# EAGLE schematic DDS Tone Shield (EAGLE 8.1.1)
REV: 0.10
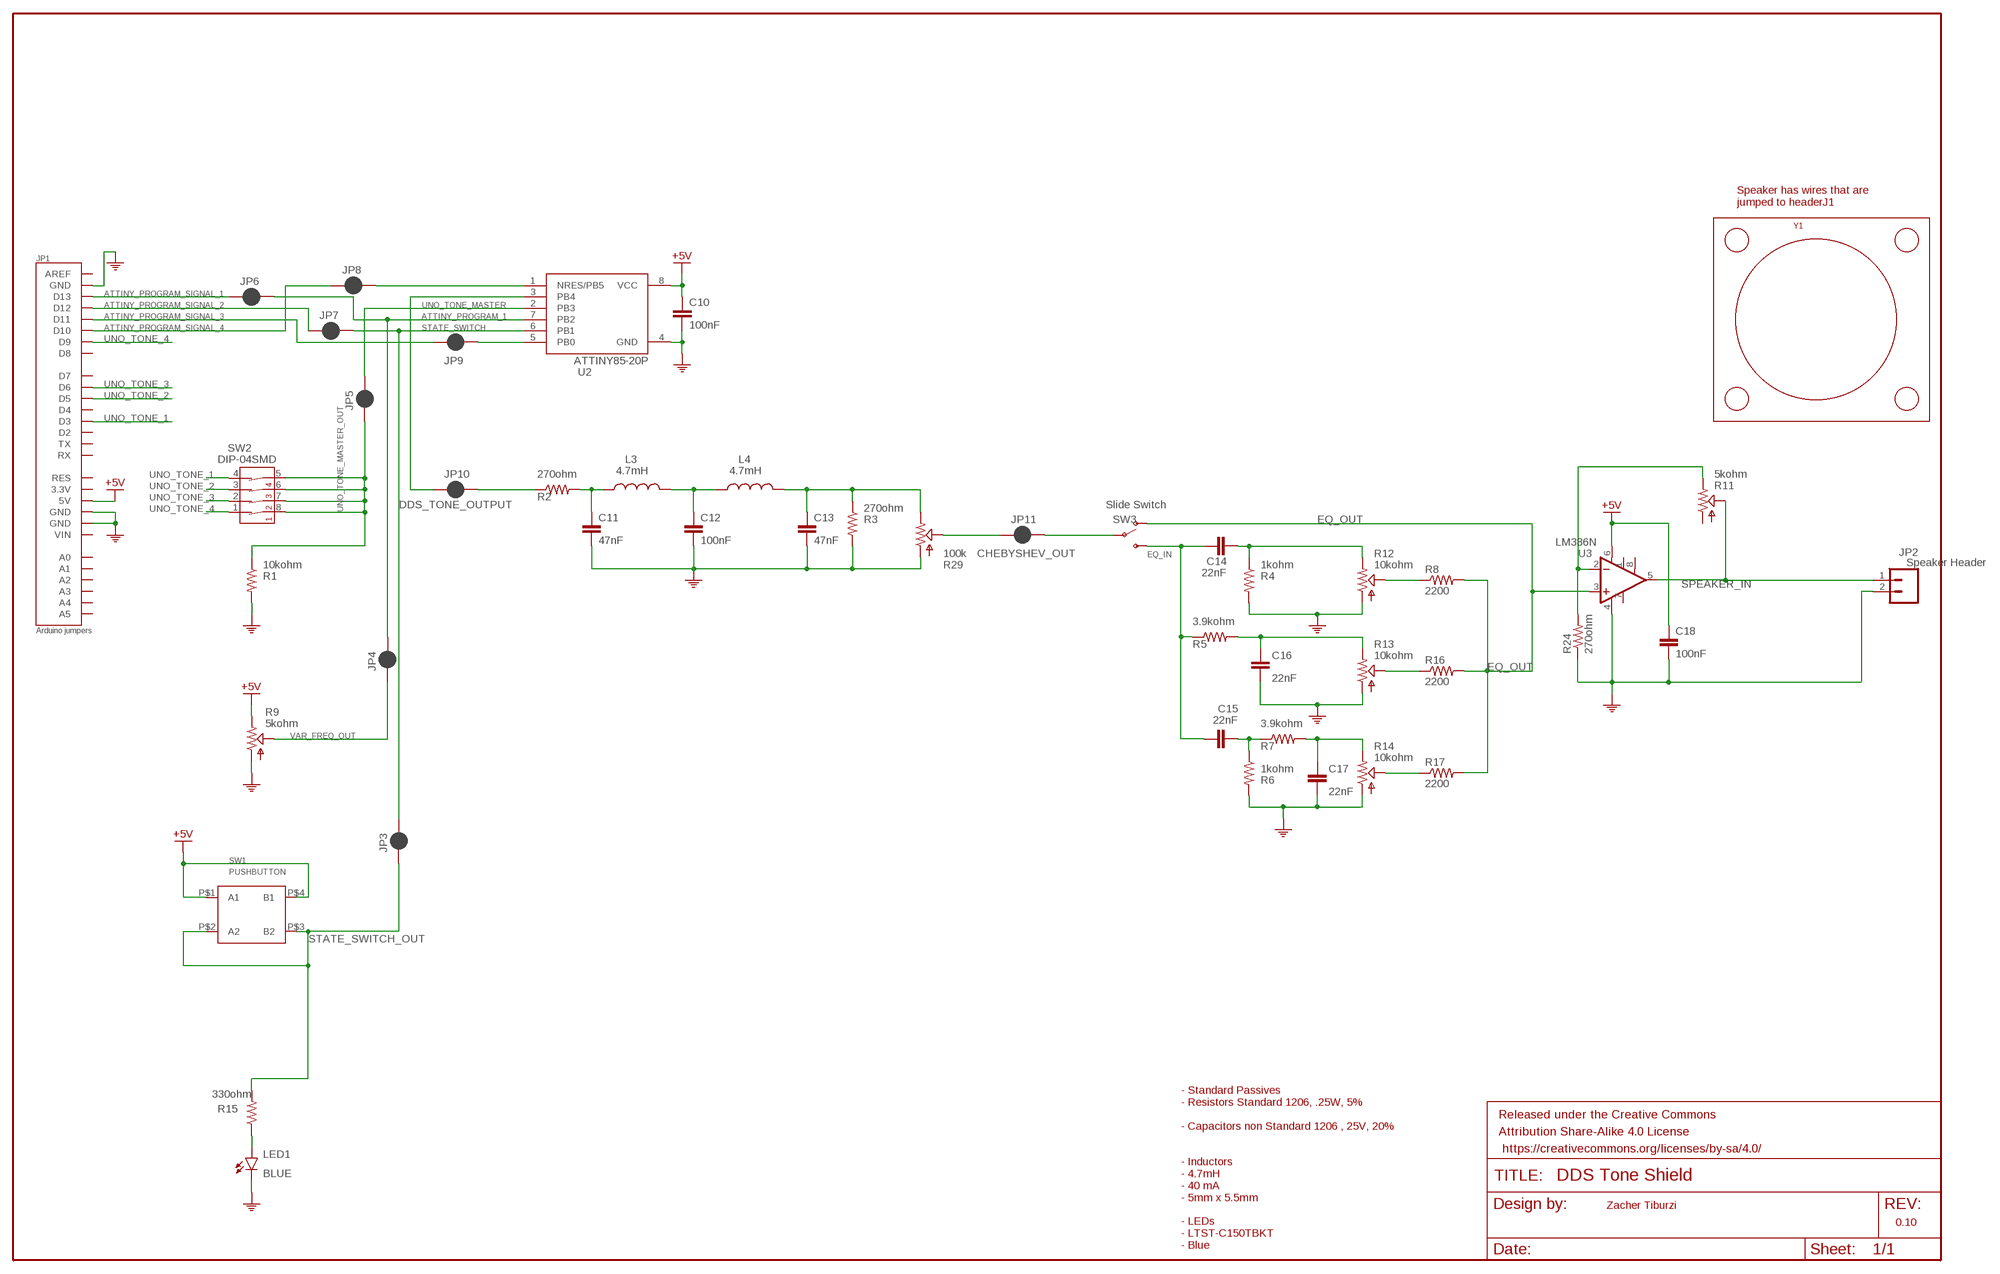
[diagram p0: schematic, sheet 1]

## Parts
C10  100nF  CAP1206  [EIA3216]
C11  47nF  CAP1206  [EIA3216]
C12  100nF  CAP1206  [EIA3216]
C13  47nF  CAP1206  [EIA3216]
C14  22nF  CAP1206  [EIA3216]
C15  22nF  CAP1206  [EIA3216]
C16  22nF  CAP1206  [EIA3216]
C17  22nF  CAP1206  [EIA3216]
C18  100nF  CAP1206  [EIA3216]
FRAME2  FRAME-LEDGER  [CREATIVE_COMMONS]
JP1  Arduino jumpers  ARDUINO_SHIELD  [DUEMILANOVE_SHIELD]
JP2  Speaker Header  CONN_02  [1X02]
JP3  JUMPER-SMT_2_NC_PASTE_SILK  [SMT-JUMPER_2_NC_PASTE_SILK]
JP4  JUMPER-SMT_2_NC_PASTE_SILK  [SMT-JUMPER_2_NC_PASTE_SILK]
JP5  JUMPER-SMT_2_NC_PASTE_SILK  [SMT-JUMPER_2_NC_PASTE_SILK]
JP6  JUMPER-SMT_2_NC_PASTE_SILK  [SMT-JUMPER_2_NC_PASTE_SILK]
JP7  JUMPER-SMT_2_NC_PASTE_SILK  [SMT-JUMPER_2_NC_PASTE_SILK]
JP8  JUMPER-SMT_2_NC_PASTE_SILK  [SMT-JUMPER_2_NC_PASTE_SILK]
JP9  JUMPER-SMT_2_NC_PASTE_SILK  [SMT-JUMPER_2_NC_PASTE_SILK]
JP10  JUMPER-SMT_2_NC_PASTE_SILK  [SMT-JUMPER_2_NC_PASTE_SILK]
JP11  JUMPER-SMT_2_NC_PASTE_SILK  [SMT-JUMPER_2_NC_PASTE_SILK]
L3  4.7mH  INDUCTOR_  [SDR0503-472JL]
L4  4.7mH  INDUCTOR_  [SDR0503-472JL]
LED1  BLUE  LED-BLUE1206  [LED-1206]
R1  10kohm  RESISTOR1206  [1206]
R2  270ohm  RESISTOR1206  [1206]
R3  270ohm  RESISTOR1206  [1206]
R4  1kohm  RESISTOR1206  [1206]
R5  3.9kohm  RESISTOR1206  [1206]
R6  1kohm  RESISTOR1206  [1206]
R7  3.9kohm  RESISTOR1206  [1206]
R8  2200  RESISTOR1206  [1206]
R9  5kohm  POT1  [RK09K/RK09D_SERIES]
R11  5kohm  POT1  [RK09K/RK09D_SERIES]
R12  10kohm  POT1  [RK09K/RK09D_SERIES]
R13  10kohm  POT1  [RK09K/RK09D_SERIES]
R14  10kohm  POT1  [RK09K/RK09D_SERIES]
R15  330ohm  RESISTOR1206  [1206]
R16  2200  RESISTOR1206  [1206]
R17  2200  RESISTOR1206  [1206]
R24  270ohm  RESISTOR1206  [1206]
R29  100k  POT1  [RK09K/RK09D_SERIES]
SW1  PUSHBUTTON  [3CSH9_MEC_PUSHBUTTON]
SW2  DIP-04SMD  [DIPSWITCH-04-SMD]
SW3  Slide Switch  SWITCH-SPDT  [JS102011SAQN]
U2  ATTINY85-20P  [PDIP08_300MIL]
U3  LM386N  LM386  [DIP08]
Y1  Speaker  SPEAKER  [CSS-40408N]

## Nets
+5V: C10.A C18.A JP1.5V R9.P$3(E) SW1.P$1(A1) SW1.P$4(B1) U2.8(VCC) U3.6(V+) ; supply symbol labelled 5V
AMP_NEG: R11.P$3(E) R24.2 U3.2(-IN)
ATTINY_PROGRAM_1: JP4.2 JP6.2 U2.7(PB2)
ATTINY_PROGRAM_SIGNAL_1: JP1.D13 JP6.1
ATTINY_PROGRAM_SIGNAL_2: JP1.D12 JP7.1
ATTINY_PROGRAM_SIGNAL_3: JP1.D11 JP9.1
ATTINY_PROGRAM_SIGNAL_4: JP1.D10 JP8.1
BPF_ATTENUATED: R14.P$2(S) R17.1
BPF_INTERMEDIATE: C15.C R6.1 R7.1
BPF_OUT: C17.A R7.2 R14.P$3(E)
CHEBYSHEV_IN: JP10.2 R2.1
CHEBYSHEV_OUT: JP11.1 R29.P$2(S)
CHEBYSHEV_STAGE_1: C11.A L3.P$1 R2.2
CHEBYSHEV_STAGE_2: C12.A L3.P$2 L4.P$1
CHEBYSHEV_STAGE_3: C13.A L4.P$2 R3.1 R29.P$3(E)
DDS_TONE_OUTPUT: JP10.1 U2.3(PB4)
EQ_IN: C14.A C15.A R5.1 SW3.P$1(S)
EQ_OUT: R8.2 R16.2 R17.2 SW3.P$2(O) U3.3(+IN)
GND: C10.C C11.C C12.C C13.C C16.C C17.C C18.C JP1.GND@0(GND) JP1.GND@1(GND) JP1.GND@2(GND) JP2.2 LED1.C R1.2 R3.2 R4.2 R6.2 R9.P$1(A) R12.P$1(A) R13.P$1(A) R14.P$1(A) R24.1 R29.P$1(A) U2.4(GND) U3.4(V-) ; supply symbol labelled GND_US
HPF_ATTENUATED: R8.1 R12.P$2(S)
HPF_OUT: C14.C R4.1 R12.P$3(E)
LED_POSITIVE: LED1.A R15.1
LPF_ATTENUATED: R13.P$2(S) R16.1
LPF_OUT: C16.A R5.2 R13.P$3(E)
PROGRAM3: JP9.2 U2.5(PB0)
PROGRAM4: JP8.2 U2.1(NRES/PB5)
SLIDE_SWITCH_IN: JP11.2 SW3.P$3(P)
SPEAKER_IN: JP2.1 R11.P$2(S) U3.5(OUT)
STATE_SWITCH: JP3.2 JP7.2 U2.6(PB1)
STATE_SWITCH_OUT: JP3.1 R15.2 SW1.P$2(A2) SW1.P$3(B2)
UNO_TONE_1: JP1.D3 SW2.4(4A)
UNO_TONE_2: JP1.D5 SW2.3(3A)
UNO_TONE_3: JP1.D6 SW2.2(2A)
UNO_TONE_4: JP1.D9 SW2.1(1A)
UNO_TONE_MASTER: JP5.2 U2.2(PB3)
UNO_TONE_MASTER_OUT: JP5.1 R1.1 SW2.5(4B) SW2.6(3B) SW2.7(2B) SW2.8(1B)
VAR_FREQ_OUT: JP4.1 R9.P$2(S)
Unconnected: JP1.3.3V JP1.A0 JP1.A1 JP1.A2 JP1.A3 JP1.A4 JP1.A5 JP1.AREF JP1.D2 JP1.D4 JP1.D7 JP1.D8 JP1.RES JP1.RX JP1.TX JP1.VIN R11.P$1(A) U3.1(GAIN) U3.7(BP) U3.8(GAIN)

## Notes on the sheet
- Speaker has wires that are 
  jumped to headerJ1
- Zacher Tiburzi
- - Standard Passives
  - Resistors Standard 1206, .25W, 5%
  
  - Capacitors non Standard 1206 , 25V, 20% 
  
  
  - Inductors
  - 4.7mH
  - 40 mA
  - 5mm x 5.5mm
  
  - LEDs
  - LTST-C150TBKT
  - Blue

## Library data of the parts
C10-C18 = 1-Generic:CAP: Capacitor Standard 0603 ceramic capacitor, and 0.1" leaded capacitor.
FRAME2 = 1-Generic:FRAME-LEDGER: Schematic Frame Standard 11x14 US Ledger frame
JP1 = DDS Tone Shield:ARDUINO_SHIELD
JP2 = DDS Tone Shield:CONN_02: Multi connection point. Often used as Generic Header-pin footprint for 0.1 inch spaced/style header connections On any of the 0.1 inch spaced packages, you can populate with these: Break Away Headers - Straight <https://www.sparkfun.com/products/116> (PRT-00116) Break Away Male Headers - Right Angle <https://www.sparkfun.com/products/553> (PRT-00553) Female Headers <https://www.sparkfun.com/products/115> (PRT-00115) Break Away Headers - Machine Pin <https://www.sparkfun.com/products/117> (PRT-00117) Break Away Female Headers - Swiss Machine Pin <https://www.sparkfun.com/products/743> (PRT-00743) For SCREWTERMINALS and SPRING TERMINALS visit here: Screw Terimnals on SparkFun.com <https://www.sparkfun.com/search/results?term=Screw+Terminals> (5mm/3.5mm/2.54mm spacing) This device is also useful as a general connection point to wire up your design to another part of your project. Our various solder wires solder well into these plated through hole pads. Hook-Up Wire - Assortment (Stranded, 22 AWG) <https://www.sparkfun.com/products/11375> (PRT-11375) Hook-Up Wire - Assortment (Solid Core, 22 AWG) <https://www.sparkfun.com/products/11367> (PRT-11367) View the entire wire category on our website here <https://www.sparkfun.com/categories/141> Special notes: Molex polarized connector foot print use with: PRT-08233 with associated crimp pins and housings. 2.54_SCREWTERM for use with PRT-10571. 3.5mm Screw Terminal footprints for PRT-08084 5mm Screw Terminal footprints for use with PRT-08432
JP3-JP11 = DDS Tone Shield:JUMPER-SMT_2_NC_PASTE: Normally closed solder jumper This jumper has an aperture in the stencil to allow solder paste to bridge the split in the wire so it's normally closed (NC). Wick off the solder to open the connection. Reapply solder to reclose the connection.
L3 L4 = DDS Tone Shield:INDUCTOR_: Inductors Basic Inductor/Choke - 0603 and 1206. Footprints are not proven and vary greatly between part numbers.
LED1 = DDS Tone Shield:LED-BLUE: Blue SMD LED Used in manufacturing of various products at SparkFun Packages: 0603 - SMD 0603 package [Product Link] <http://www.digikey.com/product-detail/en/SMLE12BC7TT86/511-1589-2-ND/1641808> 1206 - SMD1206 package [Product Link] <http://www.digikey.com/product-detail/en/lite-on-inc/LTST-C150TBKT/160-1643-1-ND/573584> SparkFun Products: ESP8266 Thing-Dev Board <https://www.sparkfun.com/products/13711> RedBoard <https://www.sparkfun.com/products/12757>; PROD_ID: DIO-09911
R1-R8 R15-R17 R24 = DDS Tone Shield:RESISTOR: Resistor Basic schematic elements and footprints for 0603, 1206, and PTH 1/10th watt (small) resistors.
R9 R11-R14 R29 = DDS Tone Shield:POT1
SW1 = DDS Tone Shield:PUSHBUTTON: URL: http://www.mouser.com/ds/2/26/3C-3E-1093.pdf
SW2 = DDS Tone Shield:DIP-04: 4-Position DIP Switch 4-circuit DIP (dual inline package) switch. Commonly used to physcially set a circuit's behavior. SparkFun Products Prototype Part; PROD_ID: SWCH-12418
SW3 = DDS Tone Shield:SWITCH-SPDT: Single Pole, Double Throw (SPDT) Switch Single-pole, double-throw (SPDT) switch. Variant Overview SMD-AYZ0202 Surface Mount DPDT Switch <https://www.sparkfun.com/products/597> (COM-00597) Used on e.g. LilyPad Arduino USB - ATmega32U4 Board <https://www.sparkfun.com/products/12049> PTH-11.6X4.0MM SPDT Mini Power Switch <https://www.sparkfun.com/products/102> (COM-00102) Used on e.g. SparkFun Simon Says - Through-Hole Soldering Kit <https://www.sparkfun.com/products/10547> (KIT-10547) PTH-11.6X4.0MM-KIT KIT version of SPDT Mini Power Switch - Simplifies soldering by removing tStop of switch pins - only one side can be soldered. PTH-11.6X4.0MM-LOCK LOCK version of SPDT Mini Power Switch - Offset pins hold switch in place for easier soldering. SMD-RIGHT-ANGLE Surface Mount Right Angle Switch <https://www.sparkfun.com/products/10860> (COM-10860) Used on e.g. SparkFun ESP8266 Thing <https://www.sparkfun.com/products/13231>
U2 = DDS Tone Shield:ATTINY85*: ATMEL ATtiny 85 Packages: P = PDIP 08 30mil S = SOIC 08 EIAJ 208mil Technologies Note: for complete ordering code (temp. range, finish, tape&reel etc.) see www.atmel.com • Supply Voltage: V = (1.8…5.5)V | [blank] = (2.7…5.5)V • Speed: 10 = 10 MHz | 20 = 20 MHz Author: Dipl.-Ing. FH Rainer Bayer HHN Hochschule Heilbronn (Heilbronn University), rainer.bayer@hs-heilbronn.de Ingenieurbüro ing-rb, mail@ing-rb.de
U3 = DDS Tone Shield:LM386: low voltage audio power amplifier SparkFun Products FabFM Radio Kit <https://www.sparkfun.com/products/11043> (KIT-11043); PROD_ID: IC-10899
Y1 = DDS Tone Shield:SPEAKER